# EasyEDA schematic 1-Schematic_Power-vibrator module.json
TITLE: Sheet_1; REV: 1.0; Date: 2025-05-30; Sheet: 1/1; Drawn By: athulkrishnaat7; Company: Your Company
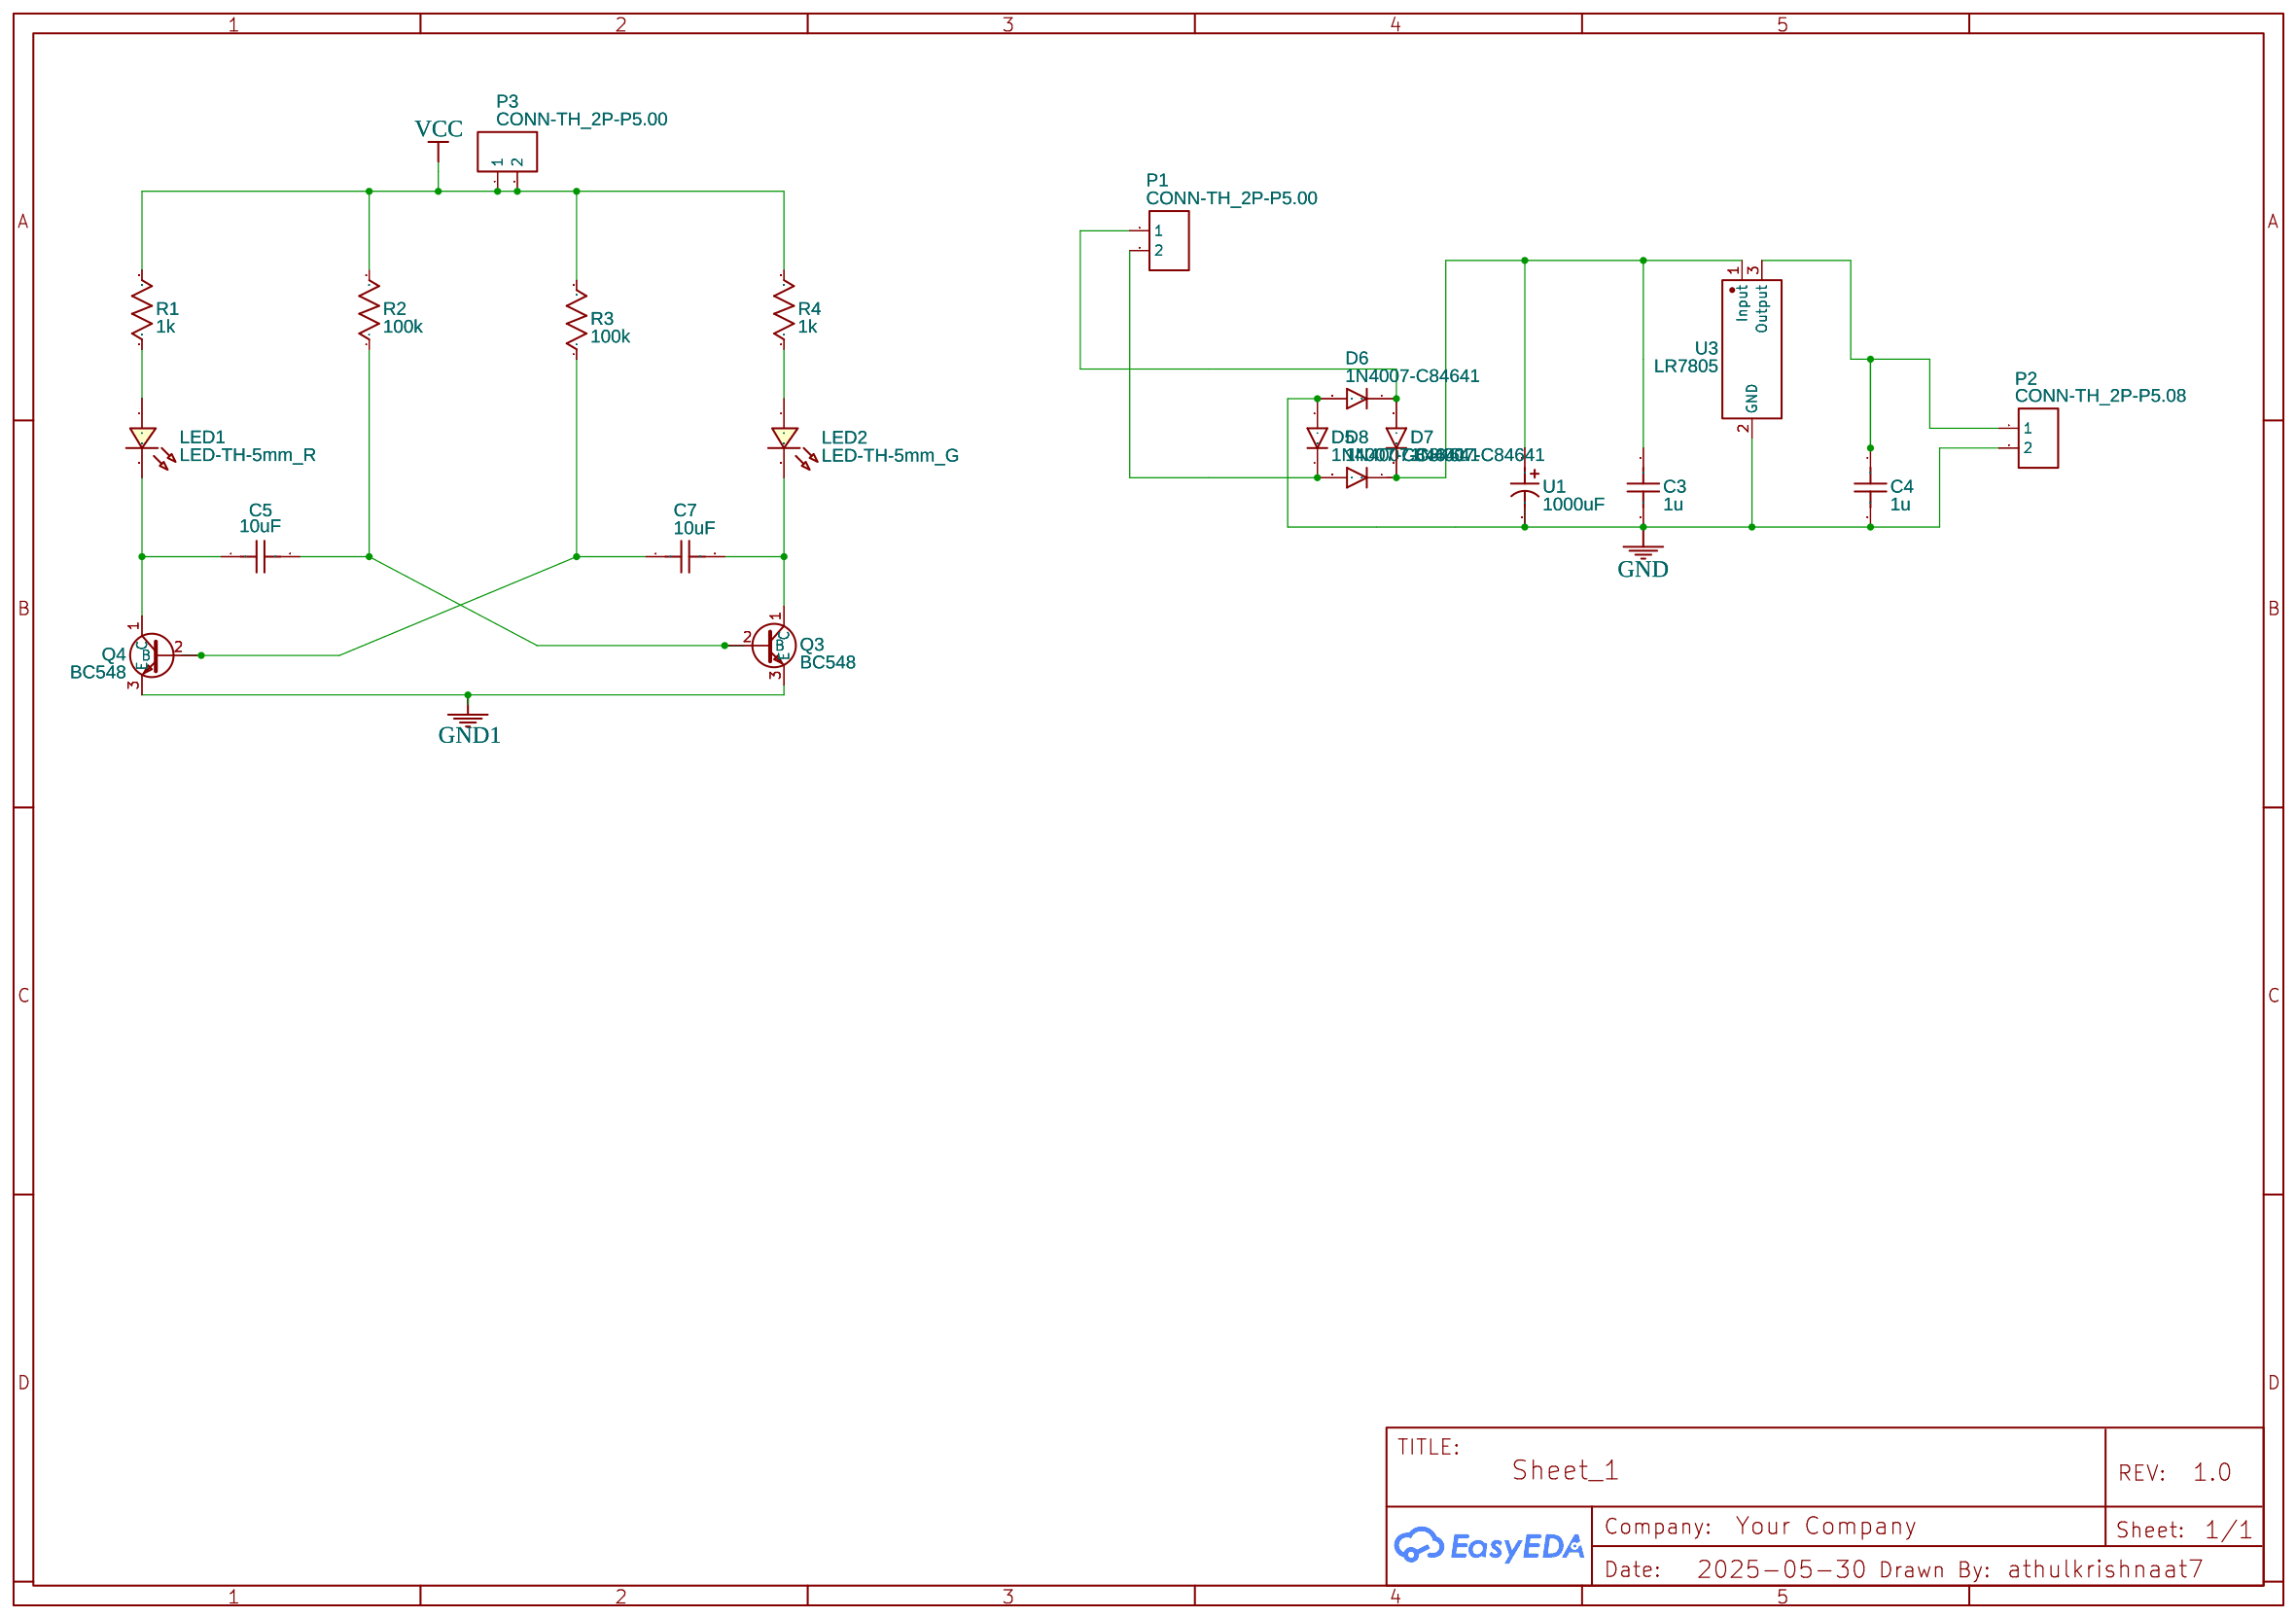
[diagram p0: schematic sheet]

## Parts
C3  1u  [RAD-0.1]
C4  1u  [RAD-0.1]
C5  10uF  [CAP-TH_L5.1-W3.2-P2.54-D0.5]
C7  10uF  [CAP-TH_L5.1-W3.2-P2.54-D0.5]
D5  1N4007-C84641  [DO-41_BD2.4-L4.7-P8.70-D0.9-RD]
D6  1N4007-C84641  [DO-41_BD2.4-L4.7-P8.70-D0.9-RD]
D7  1N4007-C84641  [DO-41_BD2.4-L4.7-P8.70-D0.9-RD]
D8  1N4007-C84641  [DO-41_BD2.4-L4.7-P8.70-D0.9-RD]
LED1  LED-TH-5mm_R  [LED-TH_BD5.0_RED]
LED2  LED-TH-5mm_G  [LED-TH_BD5.0_GREEN]
P1  CONN-TH_2P-P5.00  [CONN-TH_2P-P5.00]
P2  CONN-TH_2P-P5.08  [CONN-TH_2P-P5.00]
P3  CONN-TH_2P-P5.00  [CONN-TH_2P-P5.00]
Q3  BC548  [TO92]
Q4  BC548  [TO92]
R1  1k  [R_AXIAL-0.3]
R2  100k  [R_AXIAL-0.3]
R3  100k  [R_AXIAL-0.3]
R4  1k  [R_AXIAL-0.3]
U1  1000uF  [CAP-TH_BD12.5-P5.00-D0.8-FD-1]
U3  LR7805  [TO-220_L10.2-W4.6-P2.54_LR7805]

## Library data of the parts
C3 C4 = C_RAD-0.1_US: Contributor: LCEDA_Lib
C5 C7 = C324C106K3R5TA: Contributor: LCSC; Supplier: LCSC; Supplier Part: C1619950; Manufacturer: KEMET(基美); JLCPCB Part Class: Extended Part
D5-D8 = 1N4007-C84641: Contributor: LCSC; Supplier: LCSC; Manufacturer: 星海; Manufacturer Part: 1N4007; Supplier Part: C84641; JLCPCB Part Class: Extended Part
LED1 = LED-TH-5mm_R: Manufacturer: EVERLIGHT(台湾亿光); Manufacturer Part: 333-2SURD/S530-A3; Supplier Part: C87271; Supplier: LCSC; Contributor: LCEDA_Lib
LED2 = LED-TH-5mm_G: Manufacturer: EVERLIGHT(台湾亿光); Manufacturer Part: 333-2SYGD/S530-E2; Supplier Part: C88163; Supplier: LCSC; Contributor: LCEDA_Lib
P1 P3 = CONN-TH_2P-P5.00: Supplier: LCSC; Contributor: LCEDA_Lib
P2 = CONN-TH_2P-P5.08: Supplier: LCSC; Contributor: LCEDA_Lib
Q3 Q4 = BC548: Contributor: KiCad
R1-R4 = R_AXIAL-0.3_US: Contributor: LCEDA_Lib
U1 = EGPA350ETD102MK25S: Supplier: LCSC; Supplier Part: C2972582; Manufacturer: NCC(日本贵弥功); JLCPCB Part Class: Extended Part; Contributor: lcsc
U3 = LR7805: Contributor: LCSC; Supplier: LCSC; Supplier Part: C2846986; Manufacturer: LRC(乐山无线电); JLCPCB Part Class: Extended Part

## Nets
GND: C3.2 C4.2 D5.2(A) D6.2(A) P2.2 U1.2 U3.2(GND)
GND1: Q3.3(E) Q4.3(E)
VCC: P3.1 P3.2 R1.2 R2.2 R3.2 R4.2
Net-(C3-1): C3.1 D7.1(C) D8.1(C) U1.1 U3.1(Input)
Net-(C4-1): C4.1 P2.1 U3.3(Output)
Net-(C5-1): C5.1 LED1.2 Q4.1(C)
Net-(C5-2): C5.2 Q3.2(B) R2.1
Net-(C7-1): C7.1 Q4.2(B) R3.1
Net-(C7-2): C7.2 LED2.2 Q3.1(C)
Net-(D5-1): D5.1(C) D8.2(A) P1.2
Net-(D6-1): D6.1(C) D7.2(A) P1.1
Net-(LED1-1): LED1.1 R1.1
Net-(LED2-1): LED2.1 R4.1
